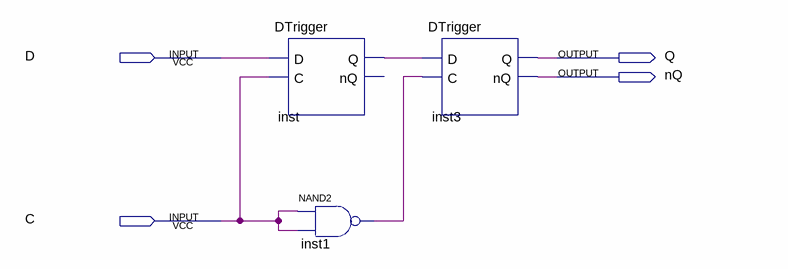
[diagram p0: schematic sheet]
// Quartus schematic DTriggerWithRisingEdge.bdf as structural Verilog: 3 symbols, 4 pins
module DTriggerWithRisingEdge (
  input  D,
  input  C,
  output Q,
  output nQ
);

  wire inst1_out, inst_q;

  DTrigger inst (.D(D), .C(C), .Q(inst_q));  // open: nQ
  nand inst1 (inst1_out, C, C);
  DTrigger inst3 (.D(inst_q), .C(inst1_out), .Q(Q), .nQ(nQ));
endmodule
